# Altium project PCB1_BioTron.PrjPcb
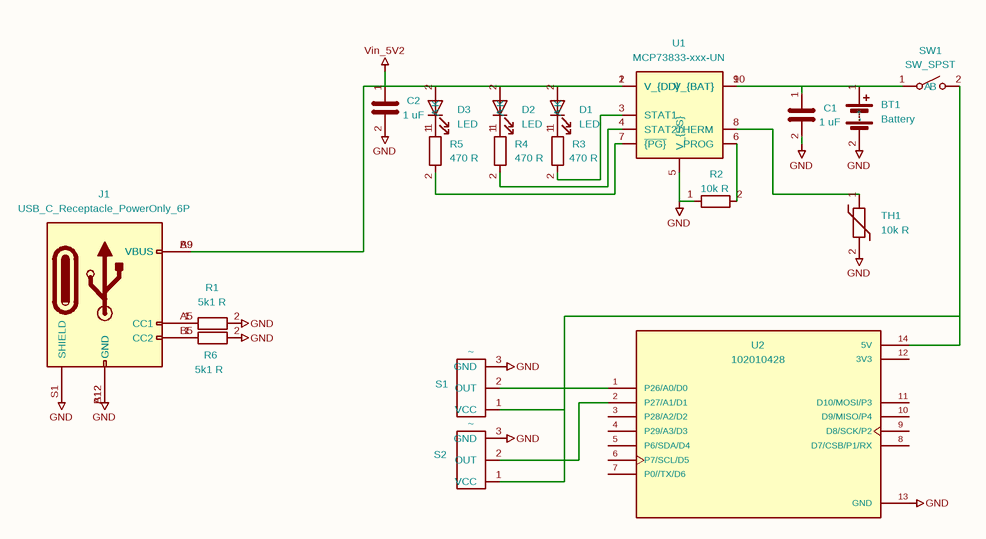
[diagram p0: PCB1_BioTron.SchDoc]
1 sheet, 19 parts. Net scope: global (net labels, ports and power ports of the same name join across sheets).
Board file: PCB1_BioTron.PcbDoc

## Sheet PCB1_BioTron.SchDoc
size 297 x 209 mm

### Parts
BT1  Battery  [PinHeader_2x01_P2.00mm_Vertical]
C1  1 uF  [C_0201_0603Metric]
C2  1 uF  [C_0201_0603Metric]
D1  LED  [LED_0603_1608Metric]
D2  LED  [LED_0603_1608Metric]
D3  LED  [LED_0603_1608Metric]
J1  USB_C_Receptacle_PowerOnly_6P  [USB_C_Receptacle_GCT_USB4125-xx-x_6P_TopMnt_Horizontal]
R1  5k1 R  [R_0603_1608Metric]
R2  10k R  [R_0603_1608Metric]
R3  470 R  [R_0603_1608Metric]
R4  470 R  [R_0603_1608Metric]
R5  470 R  [R_0603_1608Metric]
R6  5k1 R  [R_0201_0603Metric]
S1  ~  [Myoware2]
S2  ~  [Myoware2]
SW1  SW_SPST  [SW_DIP_SPSTx01_Slide_9.78x4.72mm_W7.62mm_P2.54mm]
TH1  10k R  [R_0201_0603Metric]
U1  MCP73833-xxx-UN  [MSOP-10_3x3mm_P0.5mm]
U2  102010428  [MODULE_102010428]

### Nets
GND: BT1.2(-) C1.2 C2.2 J1.A12(GND) J1.B12(GND) J1.S1(SHIELD) R1.2 R2.1 R6.2 S1.3(GND) S2.3(GND) TH1.2 U1.5(V_{SS}) U2.13(GND)
Vin_5V2: C2.1 D1.2(A) D2.2(A) D3.2(A) J1.A9(VBUS) J1.B9(VBUS) U1.1(V_{DD}) U1.2(V_{DD})
NetBT1_1: BT1.1(+) C1.1 SW1.1(A) U1.9(V_{BAT}) U1.10(V_{BAT})
NetD1_1: D1.1(K) R3.1
NetD2_1: D2.1(K) R4.1
NetD3_1: D3.1(K) R5.1
NetJ1_A5: J1.A5(CC1) R1.1
NetJ1_B5: J1.B5(CC2) R6.1
NetR2_2: R2.2 U1.6(PROG)
NetR3_2: R3.2 U1.3(STAT1)
NetR4_2: R4.2 U1.4(STAT2)
NetR5_2: R5.2 U1.7(~{{PG}})
NetS1_1: S1.1(VCC) S2.1(VCC) SW1.2(B) U2.14(5V)
NetS1_2: S1.2(OUT) U2.1(P26/A0/D0)
NetS2_2: S2.2(OUT) U2.2(P27/A1/D1)
NetTH1_1: TH1.1 U1.8(THERM)

Not connected (* = marked no-connect by the designer): U2 3(P28/A2/D2) 4(P29/A3/D3) 5(P6/SDA/D4) 6(P7/SCL/D5) 7(P0//TX/D6) 8(D7/CSB/P1/RX) 9(D8/SCK/P2) 10(D9/MISO/P4) 11(D10/MOSI/P3) 12(3V3)

### Notes on the sheet
- 1
- 2
- 3
- 4
- 5
- 6
- A
- B
- C
- D
- Title:
- File: PCB1_BioTron.kicad_sch
- Sheet: /
- KiCad E.D.A.  kicad (5.1.4)-1
- Size: A4
- Date:
- Rev:
- Id: 1/1

### Library data of the parts
BT1 = Battery: Description: Multiple-cell battery; Value: Battery; Footprint: Connector_PinHeader_2.00mm:PinHeader_2x01_P2.00mm_Vertical
C1 C2 = C: Description: Unpolarized capacitor; Value: 1 uF; Footprint: Capacitor_SMD:C_0201_0603Metric
D1-D3 = LED: Description: Light emitting diode; Sim.Pins: 1=K 2=A; Value: LED; Footprint: LED_SMD:LED_0603_1608Metric
J1 = USB_C_Receptacle_PowerOnly_6P: Description: USB Power-Only 6P Type-C Receptacle connector; Value: USB_C_Receptacle_PowerOnly_6P; Footprint: Connector_USB:USB_C_Receptacle_GCT_USB4125-xx-x_6P_TopMnt_Horizontal
R1-R6 = R: Description: Resistor
  R1: Value: 5k1 R; Footprint: Resistor_SMD:R_0603_1608Metric
  R2: Value: 10k R; Footprint: Resistor_SMD:R_0603_1608Metric
  R3-R5: Value: 470 R; Footprint: Resistor_SMD:R_0603_1608Metric
  R6: Value: 5k1 R; Footprint: Resistor_SMD:R_0201_0603Metric
S1 S2 = myoware2: Value: ~; Footprint: Epic_Library:Myoware2
SW1 = SW_SPST: Description: Single Pole Single Throw (SPST) switch; Value: SW_SPST; Footprint: Button_Switch_THT:SW_DIP_SPSTx01_Slide_9.78x4.72mm_W7.62mm_P2.54mm
TH1 = Thermistor: Description: Temperature dependent resistor; Value: 10k R; Footprint: Resistor_SMD:R_0201_0603Metric
U1 = MCP73833-xxx-UN: Description: Stand-Alone Linear Li-Ion / Li-Polymer Charge Management Controller, MSOP-10; Value: MCP73833-xxx-UN; Footprint: Package_SO:MSOP-10_3x3mm_P0.5mm
U2 = 102010428: MANUFACTURER: Seeedstudio; MF: Seeed Technology Co., Ltd; Description_1: RP2040 XIAO RP2040 series ARM® Cortex®-M0+ MCU 32-Bit Embedded Evaluation Board; MAXIMUM_PACKAGE_HEIGHT: N/A; Package: None; Price: None; Check_prices: https://www.snapeda.com/parts/102010428/Seeed+Studio/view-part/?ref=eda; STANDARD: Manufacturer Recommendations; PARTREV: 1.3; SnapEDA_Link: https://www.snapeda.com/parts/102010428/Seeed+Studio/view-part/?ref=snap; MP: 102010428; Availability: In Stock; Value: 102010428; Footprint: 102010428:MODULE_102010428